# Altium project THEP_LEDDRV_001.PrjPcb
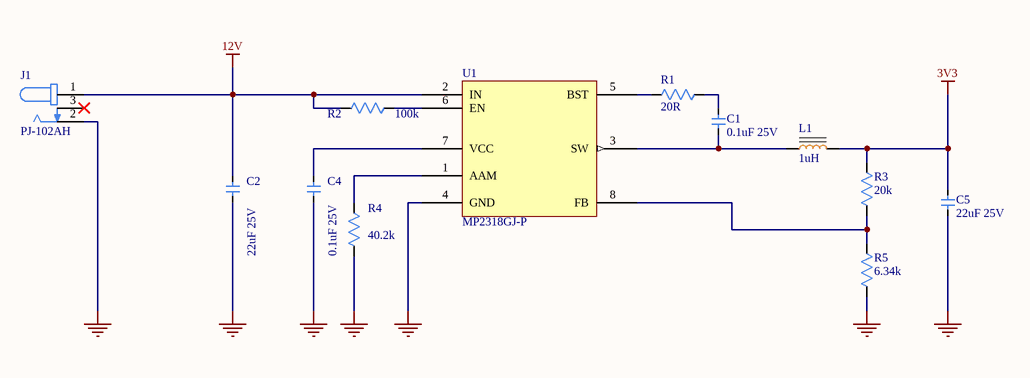
[diagram p0: Power.SchDoc]
SecurityGrade: None; Revision: 1.0; DocumentNumber: =SheetNumber; Author: Theprocyon
3 sheets, 45 parts. Net scope: global (net labels, ports and power ports of the same name join across sheets).
Board file: Main.PcbDoc
Sheets:
  Power.SchDoc
  Main.SchDoc
  Drivers.SchDoc

## Sheet Power.SchDoc: LEDDRV_POWER
size A4; Author: Theprocyon; SheetNumber: 1; SheetTotal: 3

### Parts
C1  0.1uF 25V  [CAP 0402_1005]
C2  22uF 25V  [CAP 1206_3216]
C4  0.1uF 25V  [CAP 0402_1005]
C5  22uF 25V  [CAP 1206_3216]
J1  PJ-102AH  [CUI_PJ-102AH]
L1  1uH  [IND_SRN2012T_BRN]
R1  20R  [RES 0402_1005]
R2  100k  [RES 0402_1005]
R3  20k  [RES 0402_1005]
R4  40.2k  [RES 0402_1005]
R5  6.34k  [RES 0402_1005]
U1  MP2318GJ-P  [TSOT23-8_MP2318_MNP]

### Nets
3V3: C5.2 L1.2 R3.2
12V: C2.2 J1.1 R2.2 U1.2(IN)
GND: C2.1 C4.1 C5.1 J1.2 R4.1 R5.1 U1.4(GND)
NetC1_1: C1.1 L1.1 U1.3(SW)
NetC1_2: C1.2 R1.1
NetC4_2: C4.2 U1.7(VCC)
NetR1_2: R1.2 U1.5(BST)
NetR2_1: R2.1 U1.6(EN)
NetR3_1: R3.1 R5.2 U1.8(FB)
NetR4_2: R4.2 U1.1(AAM)

Not connected (* = marked no-connect by the designer): J1 3*

### Notes on the sheet
- Title
- Number:
- Date:
- Revision:
- Sheet
- of
- Author
- Security
- Doc Size
- A4
- File:

### Library data of the parts
C1 C2 C4 C5 = Capacitor: SMT Capacitor
  C1 C4: Value: 0.1uF 25V
  C2 C5: Value: 22uF 25V
J1 = PJ-102AH: 2.0 mm Center Pin, 5.0 A, Right Angle, Through Hole, Tapered Pins, Dc Power Jack Connector, Barrel Jack; Full Part Number: PJ-102AH
L1 = Inductor Core: SMD Inductor with Core; Full Part Number: LQM2MPN1R0MGHL; Value: 1uH
R1-R5 = Resistor: SMT Resistor
  R1: Value: 20R
  R2: Value: 100k
  R3: Value: 20k
  R4: Value: 40.2k
  R5: Value: 6.34k
U1 = MP2318GJ-P: No Description Available; Mfr_Name: Monolithic Power Systems; RefDes: RefDes; Type: Type; Full part number: MP2318GJ

## Sheet Main.SchDoc: LEDDRV_MCU
size A4; SheetNumber: 2; SheetTotal: 3
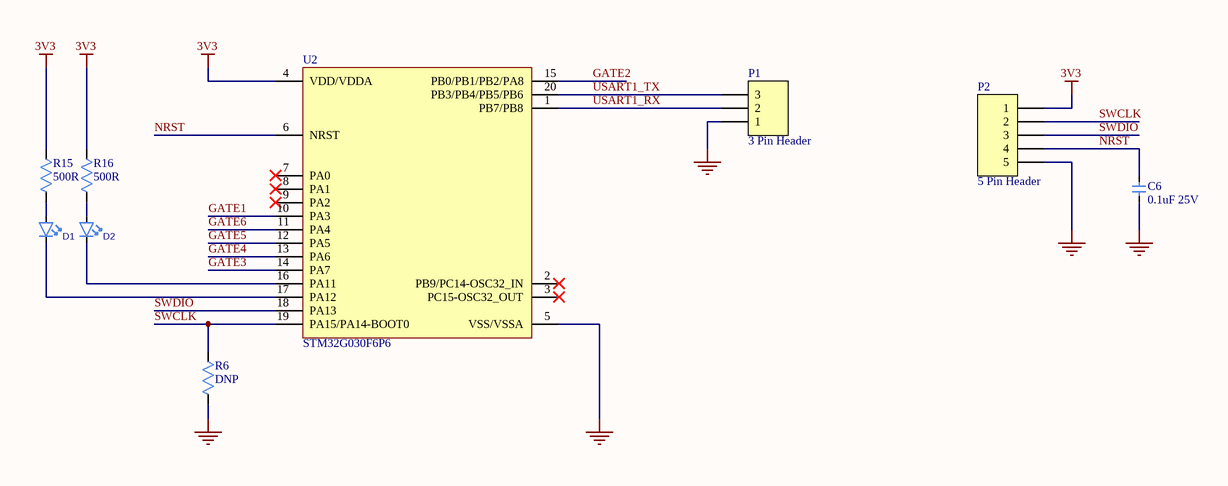
[diagram p1: Main.SchDoc]

### Parts
C6  0.1uF 25V  [CAP 0402_1005]
D1  BLU  [LED-0603-BLUE]  (value not drawn)
D2  BLU  [LED-0603-BLUE]  (value not drawn)
P1  3 Pin Header  [PCB - CONNECTOR - HEADER PIN 03]
P2  5 Pin Header  [PCB - CONNECTOR - HEADER PIN 05]  (no BOM)
R6  DNP  [RES 0402_1005]
R15  500R  [RES 0402_1005]
R16  500R  [RES 0402_1005]
U2  STM32G030F6P6  [STM32 - TSSOP20]

### Nets
3V3: P2.1 R15.1 R16.1 U2.4(VDD/VDDA)
GND: C6.1 P1.1 P2.5 R6.1 U2.5(VSS/VSSA)
GATE1: U2.10(PA3)
GATE2: U2.15(PB0/PB1/PB2/PA8)
GATE3: U2.14(PA7)
GATE4: U2.13(PA6)
GATE5: U2.12(PA5)
GATE6: U2.11(PA4)
NRST: C6.2 P2.4 U2.6(NRST)
SWCLK: P2.2 R6.2 U2.19(PA15/PA14-BOOT0)
SWDIO: P2.3 U2.18(PA13)
USART1_RX: P1.2 U2.1(PB7/PB8)
USART1_TX: P1.3 U2.20(PB3/PB4/PB5/PB6)
NetD1_A: D1.A R15.2
NetD1_K: D1.K U2.17(PA12)
NetD2_A: D2.A R16.2
NetD2_K: D2.K U2.16(PA11)

Not connected (* = marked no-connect by the designer): U2 2(PB9/PC14-OSC32_IN)* 3(PC15-OSC32_OUT)* 7(PA0)* 8(PA1)* 9(PA2)*

### Notes on the sheet
- Title
- Number:
- Date:
- Revision:
- Sheet
- of
- Author
- Security
- Doc Size
- A4
- File:

### Library data of the parts
C6 = Capacitor: SMT Capacitor; Value: 0.1uF 25V
D1 D2 = LED_BLUE: CHIP LED BLUE; Part Number: LG L29K Smartled Green; Manufacturer: Multicomp; Manufacturer Part Number: LG L29K-G2J1-24-Z; Value: L0603G; Note: 2,24..5.6 mcd, Vfmin=1.7V; Artikkelnr Noca: N.A.; Datasheet: http://www.osram-os.com/Graphics/XPic2/00077107_0.pdf; Footprint Doc: 0603; LatestRevisionDate: 2014-10-28; Pin Count: 2; Publisher: Nordic Semiconductor; Published: 2014-10-28; Supplier: Digi-Key; Supplier part number: 475-2709-1-ND; 2nd source Supplier: *; 2nd source part number: *; Artikkelnr Simpro: N.A.
R6 R15 R16 = Resistor: SMT Resistor
  R6: Value: DNP
  R15 R16: Value: 500R
U2 = STM32G030F6P6: No Description Available; Full Part Number: STM32G030F6P6
P1 = 3 Pin Header: Value: 3 Pin Header
P2 = 5 Pin Header: Value: 5 Pin Header

## Sheet Drivers.SchDoc: LEDDRV_DRIVERS
size A4; SheetNumber: 3; SheetTotal: 3
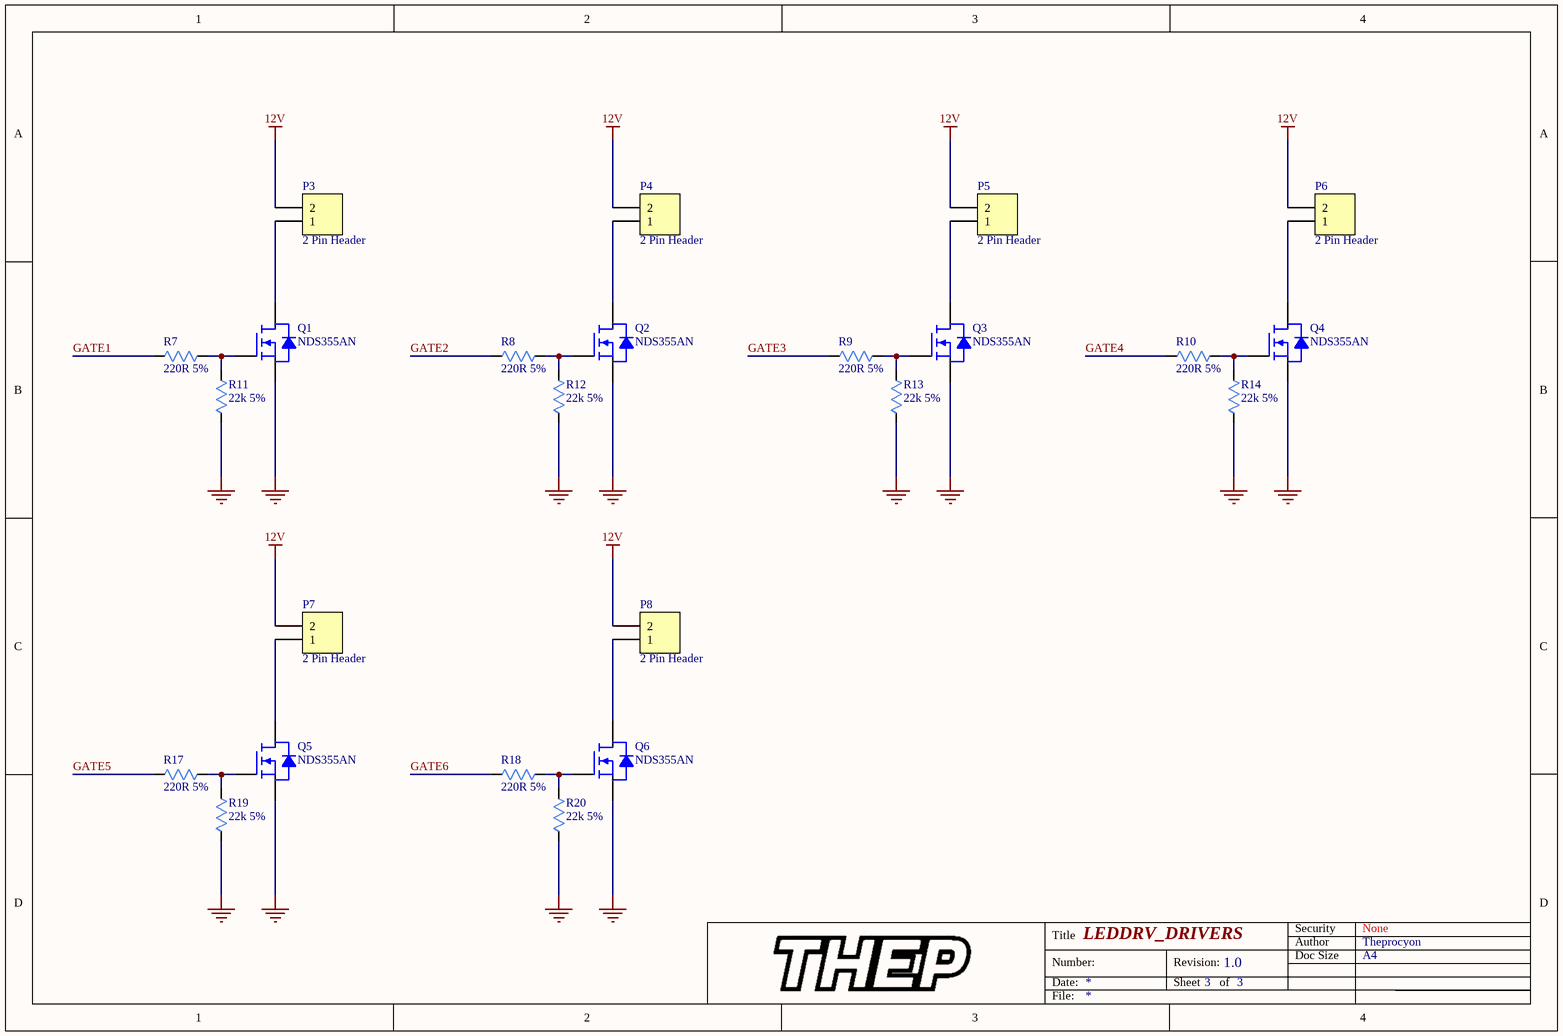
[diagram p2: Drivers.SchDoc]

### Parts
P3  2 Pin Header  [PCB - CONNECTOR - HEADER PIN 02]
P4  2 Pin Header  [PCB - CONNECTOR - HEADER PIN 02]
P5  2 Pin Header  [PCB - CONNECTOR - HEADER PIN 02]
P6  2 Pin Header  [PCB - CONNECTOR - HEADER PIN 02]
P7  2 Pin Header  [PCB - CONNECTOR - HEADER PIN 02]
P8  2 Pin Header  [PCB - CONNECTOR - HEADER PIN 02]
Q1  NDS355AN  [SOT95P240X120-3N]
Q2  NDS355AN  [SOT95P240X120-3N]
Q3  NDS355AN  [SOT95P240X120-3N]
Q4  NDS355AN  [SOT95P240X120-3N]
Q5  NDS355AN  [SOT95P240X120-3N]
Q6  NDS355AN  [SOT95P240X120-3N]
R7  220R 5%  [RES 0402_1005]
R8  220R 5%  [RES 0402_1005]
R9  220R 5%  [RES 0402_1005]
R10  220R 5%  [RES 0402_1005]
R11  22k 5%  [RES 0402_1005]
R12  22k 5%  [RES 0402_1005]
R13  22k 5%  [RES 0402_1005]
R14  22k 5%  [RES 0402_1005]
R17  220R 5%  [RES 0402_1005]
R18  220R 5%  [RES 0402_1005]
R19  22k 5%  [RES 0402_1005]
R20  22k 5%  [RES 0402_1005]

### Nets
12V: P3.2 P4.2 P5.2 P6.2 P7.2 P8.2
GND: Q1.3(S) Q2.3(S) Q3.3(S) Q4.3(S) Q5.3(S) Q6.3(S) R11.1 R12.1 R13.1 R14.1 R19.1 R20.1
GATE1: R7.1
GATE2: R8.1
GATE3: R9.1
GATE4: R10.1
GATE5: R17.1
GATE6: R18.1
NetP3_1: P3.1 Q1.2(D)
NetP4_1: P4.1 Q2.2(D)
NetP5_1: P5.1 Q3.2(D)
NetP6_1: P6.1 Q4.2(D)
NetP7_1: P7.1 Q5.2(D)
NetP8_1: P8.1 Q6.2(D)
NetQ1_1: Q1.1(G) R7.2 R11.2
NetQ2_1: Q2.1(G) R8.2 R12.2
NetQ3_1: Q3.1(G) R9.2 R13.2
NetQ4_1: Q4.1(G) R10.2 R14.2
NetQ5_1: Q5.1(G) R17.2 R19.2
NetQ6_1: Q6.1(G) R18.2 R20.2

### Notes on the sheet
- Title
- Number:
- Date:
- Revision:
- Sheet
- of
- Author
- Security
- Doc Size
- A4
- File:

### Library data of the parts
Q1-Q6 = NDS355AN: N-CHANNEL ENHANCEMENT MODE MOSFET; pin to pad: 2>3 3>2; Full Part Number: NDS355AN; Value: NDS355AN
R7-R14 R17-R20 = Resistor: SMT Resistor
  R7-R10 R17 R18: Value: 220R 5%
  R11-R14 R19 R20: Value: 22k 5%
P3-P8 = 2 Pin Header: Value: 2 Pin Header

## Nets that join several sheets
3V3: Power (C5.2 L1.2 R3.2), Main (P2.1 R15.1 R16.1 U2.4)
12V: Power (C2.2 J1.1 R2.2 U1.2), Drivers (6 pins)
GND: Power (7 pins), Main (5 pins), Drivers (12 pins)
GATE1: Main (U2.10), Drivers (R7.1)
GATE2: Main (U2.15), Drivers (R8.1)
GATE3: Main (U2.14), Drivers (R9.1)
GATE4: Main (U2.13), Drivers (R10.1)
GATE5: Main (U2.12), Drivers (R17.1)
GATE6: Main (U2.11), Drivers (R18.1)